# Altium project Arduino_DIY_V1.0.PrjPcb
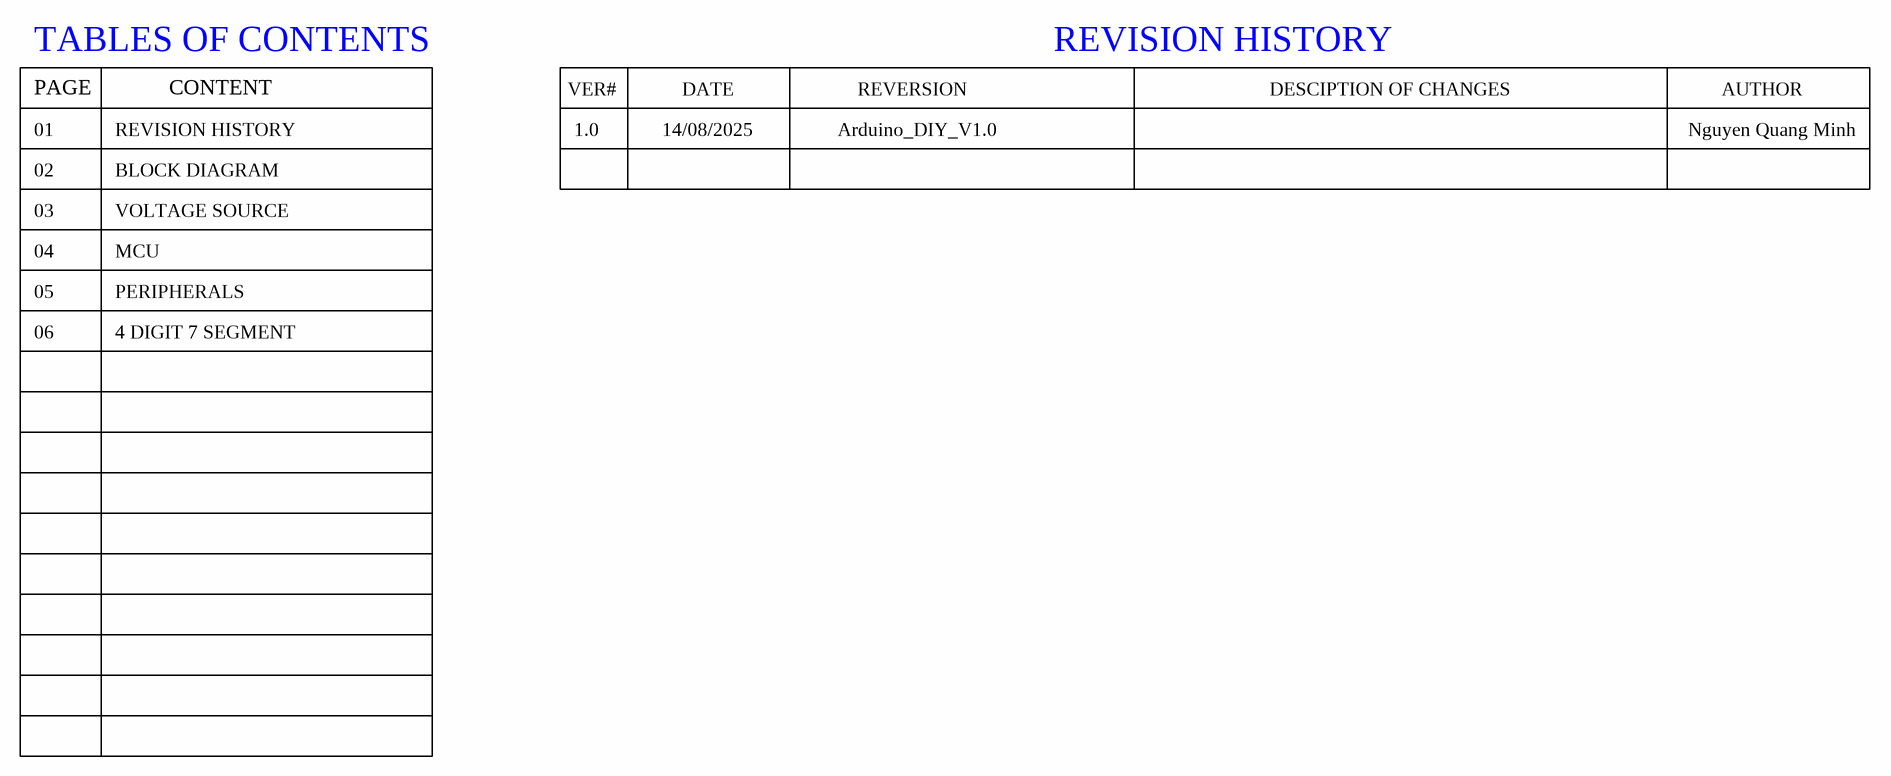
[diagram p0: REVISION HISTORY.SchDoc]
6 sheets, 122 parts. Net scope: flat (ports and power ports of the same name join across sheets).
Board files: Arduino_DIY_V1.0.PcbDoc, Multi_Board.PcbDoc
Sheets:
  REVISION HISTORY.SchDoc
  BLOCK DIAGRAM.SchDoc
  VOLTAGE SOURCE.SchDoc
  MCU.SchDoc
  PERIPHERALS.SchDoc
  4 DIGIT 7 SEGMENT.SchDoc

## Sheet REVISION HISTORY.SchDoc: REVISION HISTORY
size A3; Author: NGUYEN QUANG MINH; SheetNumber: 1; SheetTotal: 5; ProjectTitle: Arduino_DIY_V1.0

### Notes on the sheet
- TABLES OF CONTENTS
- PAGE
- CONTENT
- VER#
- DATE
- REVERSION
- REVISION HISTORY
- DESCIPTION OF CHANGES
- AUTHOR
- 01
- 1.0
- 14/08/2025
- Arduino_DIY_V1.0
- Nguyen Quang Minh
- 02
- 03
- BLOCK DIAGRAM
- VOLTAGE SOURCE
- 04
- MCU
- 05
- 06
- PERIPHERALS
- 4 DIGIT 7 SEGMENT
- Author:
- Title:
- Size:
- A3
- Project:
- Revision:
- Modified Date:
- CheckedBy:
- Date:
- SW Version:

## Sheet BLOCK DIAGRAM.SchDoc: BLOCK DIAGRAM
size A3; Author: NGUYEN QUANG MINH; SheetNumber: 2; SheetTotal: 5; ProjectTitle: Arduino_DIY_V1.0

### Notes on the sheet
- Author:
- Title:
- Size:
- A3
- Project:
- Revision:
- Modified Date:
- CheckedBy:
- Date:
- SW Version:
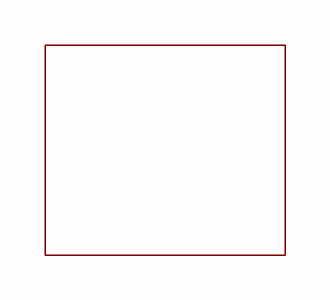
[diagram p1: BLOCK DIAGRAM.SchDoc]

## Sheet VOLTAGE SOURCE.SchDoc: VOLTAGE SOURCE
size A3; Author: NGUUYEN QUANG MINH; Organization: My Company; Address1: Address Line 1; Address2: Address Line 2; Address3: Address Line 3; Address4: Address Line 4; SheetNumber: 3; SheetTotal: 5; ProjectTitle: Arduino_DIY_V1.0
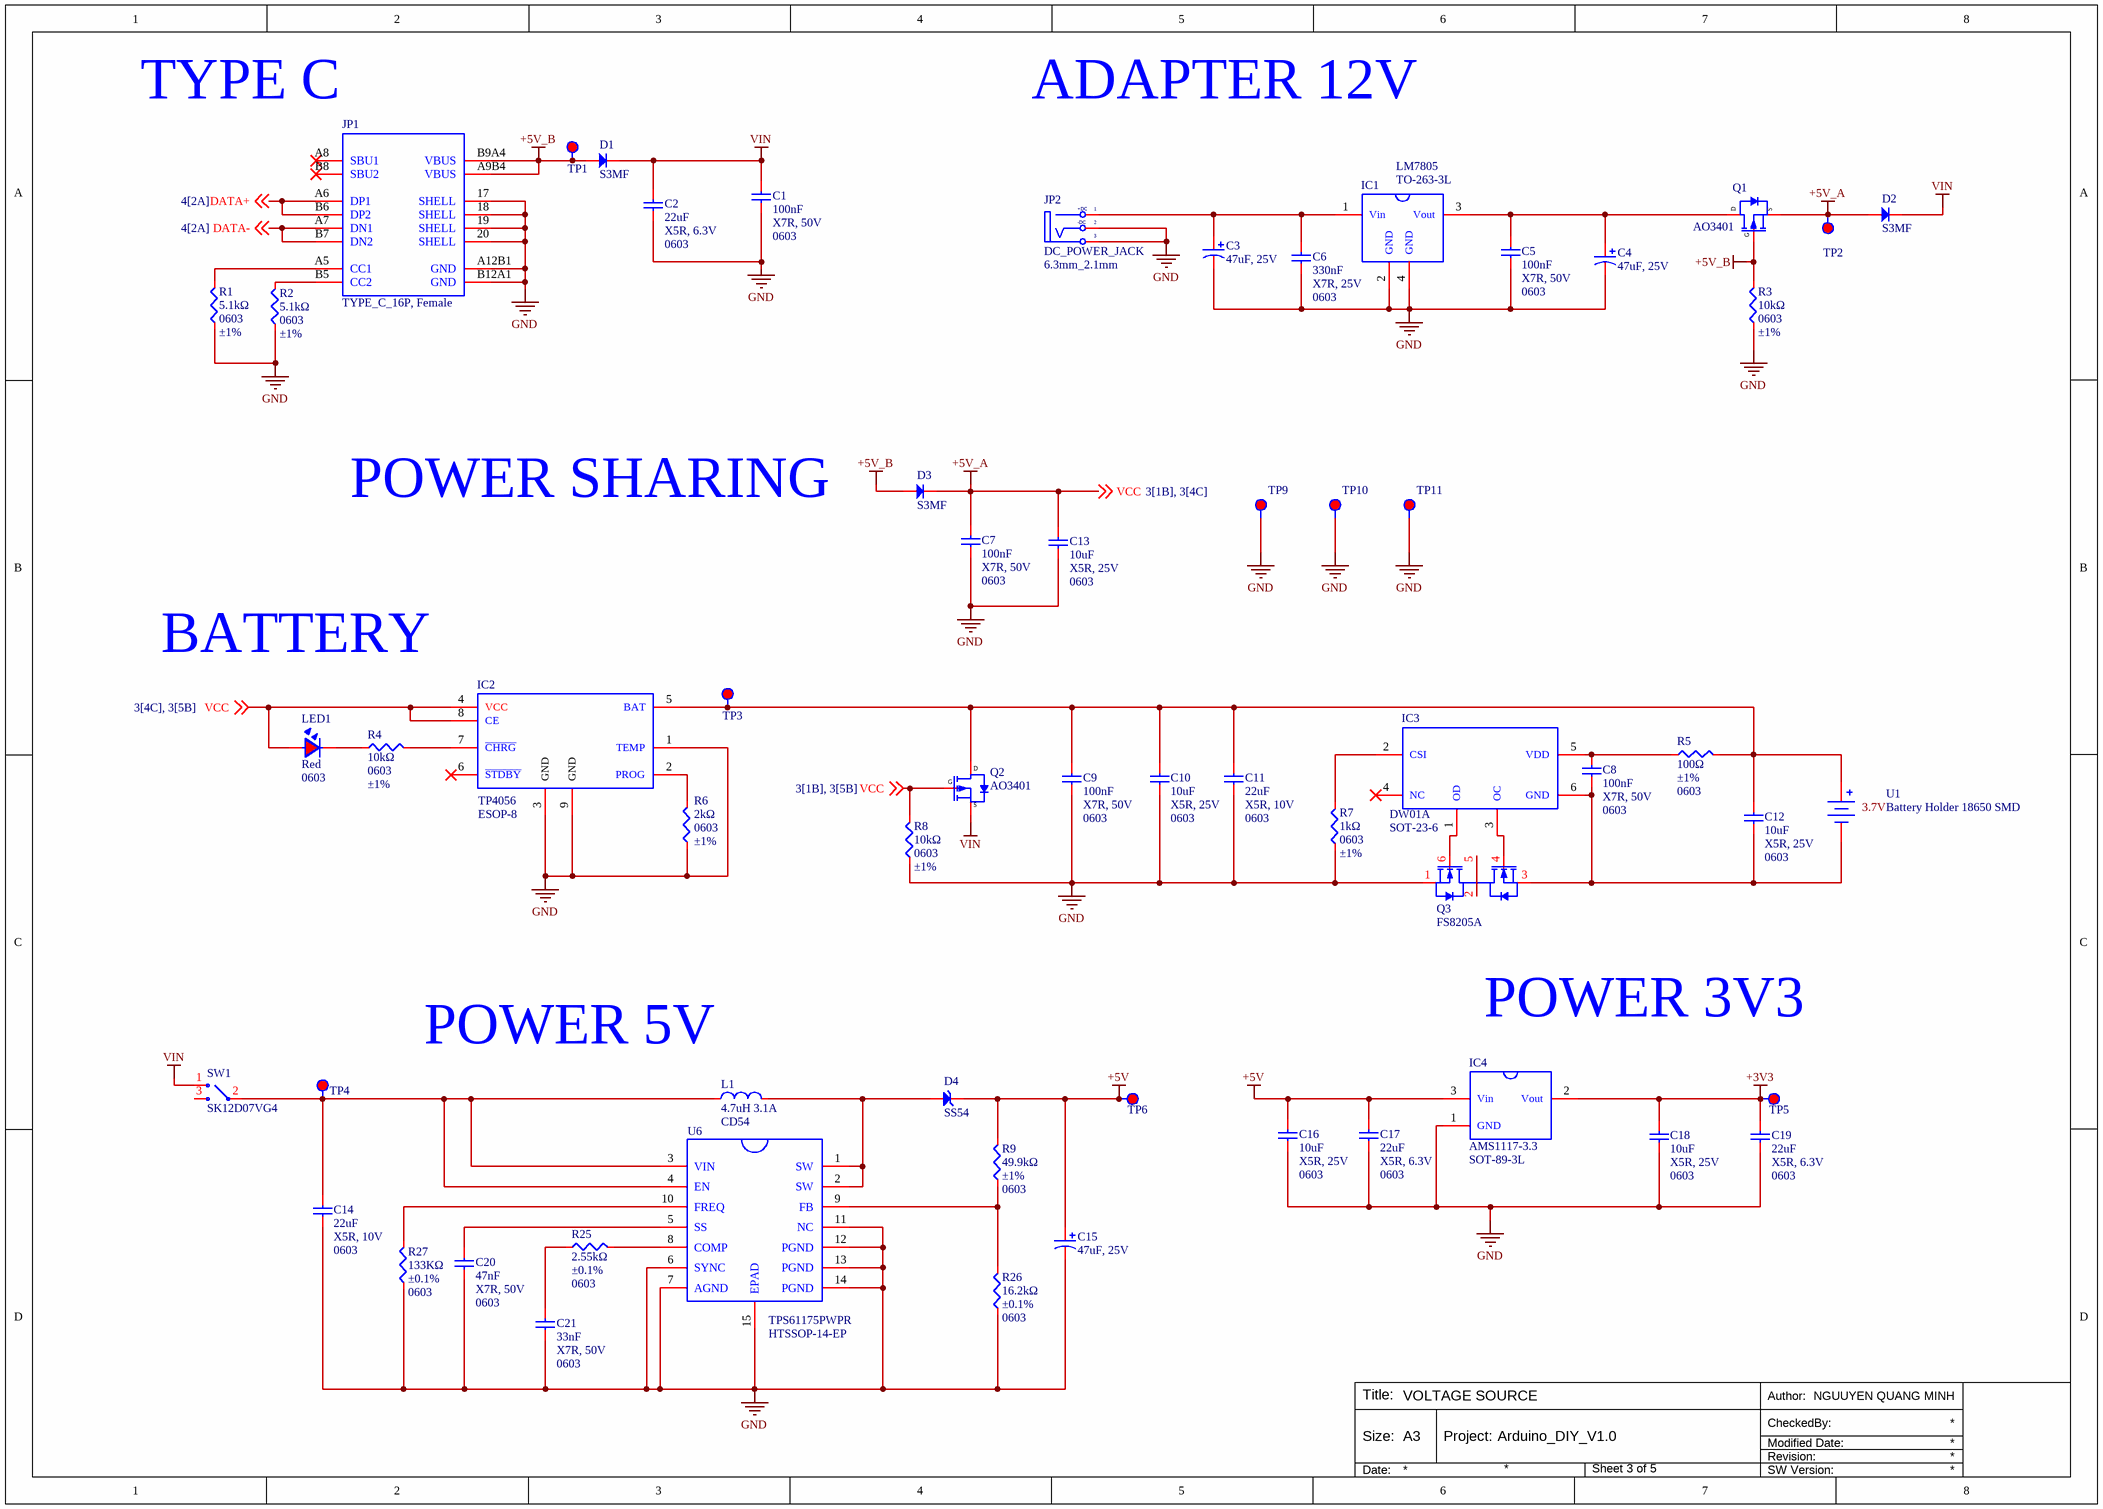
[diagram p2: VOLTAGE SOURCE.SchDoc]

### Parts
C1  100nF  Temperature Coefficient: X7R, 50V  Package: 0603  [C0603]
C2  22uF  Temperature Coefficient: X5R, 6.3V  Package: 0603  [C0603]
C3  47uF, 25V  [CAP_ALU_C]
C4  47uF, 25V  [CAP_ALU_C]
C5  100nF  Temperature Coefficient: X7R, 50V  Package: 0603  [C0603]
C6  330nF  Temperature Coefficient: X7R, 25V  Package: 0603  [C0603]
C7  100nF  Temperature Coefficient: X7R, 50V  Package: 0603  [C0603]
C8  100nF  Temperature Coefficient: X7R, 50V  Package: 0603  [C0603]
C9  100nF  Temperature Coefficient: X7R, 50V  Package: 0603  [C0603]
C10  10uF  Temperature Coefficient: X5R, 25V  Package: 0603  [C0603]
C11  22uF  Temperature Coefficient: X5R, 10V  Package: 0603  [C0603]
C12  10uF  Temperature Coefficient: X5R, 25V  Package: 0603  [C0603]
C13  10uF  Temperature Coefficient: X5R, 25V  Package: 0603  [C0603]
C14  22uF  Temperature Coefficient: X5R, 10V  Package: 0603  [C0603]
C15  47uF, 25V  [CAP_ALU_C]
C16  10uF  Temperature Coefficient: X5R, 25V  Package: 0603  [C0603]
C17  22uF  Temperature Coefficient: X5R, 6.3V  Package: 0603  [C0603]
C18  10uF  Temperature Coefficient: X5R, 25V  Package: 0603  [C0603]
C19  22uF  Temperature Coefficient: X5R, 6.3V  Package: 0603  [C0603]
C20  47nF  Temperature Coefficient: X7R, 50V  Package: 0603  [C0603]
C21  33nF  Temperature Coefficient: X7R, 50V  Package: 0603  [C0603]
D1  S3MF  [D_SMAF_L3.5-W2.6-LS4.7-RD]
D2  S3MF  [D_SMAF_L3.5-W2.6-LS4.7-RD]
D3  S3MF  [D_SMAF_L3.5-W2.6-LS4.7-RD]
D4  SS54  [SMC]
IC1  LM7805  [TO-263-3L]
IC2  TP4056  [ESOP-8]
IC3  DW01A  [SOT-23-6]
IC4  AMS1117-3.3  [SOT-89-3L]
JP1  TYPE_C_16P, Female  [TYPE_C_16P]
JP2  DC_POWER_JACK  Reference: 6.3mm_2.1mm  [DC_POWER_JACK_6.3mm_2.1mm]
L1  4.7uH 3.1A  [CD54]
LED1  Red  Package: 0603  [LED0603_RED]
Q1  AO3401  [TF_SOT_23_3]
Q2  AO3401  [TF_SOT_23_3]
Q3  FS8205A  [TF_SOT23-6]
R1  5.1kΩ  Package: 0603  Tolerance: ±1%  [R0603]
R2  5.1kΩ  Package: 0603  Tolerance: ±1%  [R0603]
R3  10kΩ  Package: 0603  Tolerance: ±1%  [R0603]
R4  10kΩ  Package: 0603  Tolerance: ±1%  [R0603]
R5  100Ω  Tolerance: ±1%  Package: 0603  [R0603]
R6  2kΩ  Package: 0603  Tolerance: ±1%  [R0603]
R7  1kΩ  Package: 0603  Tolerance: ±1%  [R0603]
R8  10kΩ  Package: 0603  Tolerance: ±1%  [R0603]
R9  49.9kΩ  Tolerance: ±1%  Package: 0603  [R0603]
R25  2.55kΩ  Tolerance: ±0.1%  Package: 0603  [R0603]
R26  16.2kΩ  Tolerance: ±0.1%  Package: 0603  [R0603]
R27  133KΩ  Tolerance: ±0.1%  Package: 0603  [R0603]
SW1  SK12D07VG4  [SK12D07VG4]
TP1  Test Point  [TEST_POINT]  (value not drawn)  (no BOM)
TP2  Test Point  [TEST_POINT]  (value not drawn)  (no BOM)
TP3  Test Point  [TEST_POINT]  (value not drawn)  (no BOM)
TP4  Test Point  [TEST_POINT]  (value not drawn)  (no BOM)
TP5  Test Point  [TEST_POINT]  (value not drawn)  (no BOM)
TP6  Test Point  [TEST_POINT]  (value not drawn)  (no BOM)
TP9  Test Point  [TEST_POINT]  (value not drawn)  (no BOM)
TP10  Test Point  [TEST_POINT]  (value not drawn)  (no BOM)
TP11  Test Point  [TEST_POINT]  (value not drawn)  (no BOM)
U1  Battery Holder 18650 SMD  [PIN_18650_1S_HOLDER_SMD]
U6  TPS61175PWPR  [HTSSOP-14-EP]

### Nets
+3V3: C18.2 C19.2 IC4.2(Vout) TP5.1
+5V: C15.1 C16.2 C17.2 D4.1 IC4.3(Vin) R9.2 TP6.1
+5V_A: C7.2 C13.2 D2.2 D3.1 IC2.4(VCC) IC2.8(CE) LED1.1 Q1.2(S) Q2.1(G) R8.2 TP2.1 ; off-sheet VCC  [also labelled VCC]
+5V_B: D1.2 D3.2 JP1.A9B4(VBUS) JP1.B9A4(VBUS) Q1.1(G) R3.2 TP1.1
GND: C1.1 C2.1 C3.2 C4.2 C5.1 C6.1 C7.1 C9.1 C10.1 C11.1 C13.1 C14.1 C15.2 C16.1 C17.1 C18.1 C19.1 C20.1 C21.1 IC1.2(GND) IC1.4(GND) IC2.1(TEMP) IC2.3(GND) IC2.9(GND) IC4.1(GND) JP1.17(SHELL) JP1.18(SHELL) JP1.19(SHELL) JP1.20(SHELL) JP1.A12B1(GND) JP1.B12A1(GND) JP2.2(TN) JP2.3(S) Q3.1(S1) R1.1 R2.1 R3.1 R6.1 R7.1 R8.1 R26.1 R27.1 TP9.1 TP10.1 TP11.1 U6.6(SYNC) U6.7(AGND) U6.11(NC) U6.12(PGND) U6.13(PGND) U6.14(PGND) U6.15(EPAD)
VIN: C1.2 C2.2 D1.1 D2.1 Q2.2(S) SW1.1
DATA+: JP1.A6(DP1) JP1.B6(DP2) ; off-sheet DATA+
DATA-: JP1.A7(DN1) JP1.B7(DN2) ; off-sheet DATA-
NetC3_1: C3.1 C6.2 IC1.1(Vin) JP2.1(T)
NetC4_1: C4.1 C5.2 IC1.3(Vout) Q1.3(D)
NetC8_1: C8.1 C12.1 IC3.6(GND) Q3.3(S2) U1.2
NetC8_2: C8.2 IC3.5(VDD) R5.1
NetC9_2: C9.2 C10.2 C11.2 C12.2 IC2.5(BAT) Q2.3(D) R5.2 TP3.1 U1.1
NetC14_2: C14.2 L1.1 SW1.2 TP4.1 U6.3(VIN) U6.4(EN)
NetC20_2: C20.2 U6.5(SS)
NetC21_2: C21.2 R25.1
NetD4_2: D4.2 L1.2 U6.1(SW) U6.2(SW)
NetIC2_2: IC2.2(PROG) R6.2
NetIC2_7: IC2.7(~{CHRG}) R4.2
NetIC3_1: IC3.1(OD) Q3.6(G1)
NetIC3_2: IC3.2(CSI) R7.2
NetIC3_3: IC3.3(OC) Q3.4(G2)
NetJP1_A5: JP1.A5(CC1) R1.2
NetJP1_B5: JP1.B5(CC2) R2.2
NetLED1_2: LED1.2 R4.1
NetQ3_2: Q3.2(D1/D2) Q3.5(D1/D2)
NetR9_1: R9.1 R26.2 U6.9(FB)
NetR25_2: R25.2 U6.8(COMP)
NetR27_2: R27.2 U6.10(FREQ)

Not connected (* = marked no-connect by the designer): IC2 6(~{STDBY})*; IC3 4(NC)*; JP1 A8(SBU1)* B8(SBU2)*; SW1 3

### Notes on the sheet
- TYPE C
- ADAPTER 12V
- POWER SHARING
- BATTERY
- POWER 5V
- POWER 3V3
- Author:
- Title:
- Size:
- A3
- Project:
- Revision:
- Modified Date:
- CheckedBy:
- Date:
- SW Version:
- (in symbol DC_POWER_JACK_6.3mm_2.1mm) +DC; -DC
- (in symbol PIN_18650_1S_HOLDER_SMD) 3.7V

### Library data of the parts
C1 C5 C7-C9 = C0603_MLCC_100nF_X7R_50V: 50V 100nF X7R ±10% 0603 Multilayer Ceramic Capacitors MLCC - SMD/SMT ROHS; Manufacturer: YAGEO; Mfr. Part: CC0603KRX7R9BB104; LCSC Part: C14663; Capacitance: 100nF; Link: https://www.lcsc.com/product-detail/C14663.html; Tolerance: ±10%; Voltage Rating: 50V
C2 C17 C19 = C0603_MLCC_22uF_X5R_6.3V: 6.3V 22uF X5R ±20% 0603 Multilayer Ceramic Capacitors MLCC - SMD/SMT ROHS; Manufacturer: YAGEO; Mfr. Part: CC0603MRX5R5BB226; LCSC Part: C109448; Capacitance: 22uF; Link: https://www.lcsc.com/product-detail/C109448.html; Voltage Rating: 6.3V; Tolerance: ±20%
C3 C4 C15 = C_ALU_47uF_25V_C: 25V ±20% 47uF SMD,D5xL6.1mm Hybrid Aluminum Electrolytic Capacitors ROHS; Manufacturer: PANASONIC; Mfr. Part: EEHZK1E470R; LCSC Part: C542300; Capacitance: 47uF; Link: https://www.lcsc.com/product-detail/C542300.html; Voltage Rating: 25V; Tolerance: ±20%; Package: C
C6 = C0603_MLCC_330nF_X7R_25V: 25V 330nF X7R ±10% 0603 Multilayer Ceramic Capacitors MLCC - SMD/SMT ROHS; Manufacturer: YAGEO; Mfr. Part: CC0603KRX7R8BB334; LCSC Part: C107070; Capacitance: 330nF; Link: https://www.lcsc.com/product-detail/C107070.html; Voltage Rating: 25V; Tolerance: ±10%
C10 C12 C13 C16 C18 = C0603_MLCC_10uF_X5R_25V: 25V 10uF X5R ±20% 0603 Multilayer Ceramic Capacitors MLCC - SMD/SMT ROHS; Manufacturer: YAGEO; Mfr. Part: CC0603MRX5R8BB106; LCSC Part: C596327; Capacitance: 10uF; Link: https://www.lcsc.com/product-detail/C596327.html; Tolerance: ±20%; Voltage Rating: 25V
C11 C14 = C0603_MLCC_22uF_X5R_10V: 10V 22uF X5R ±20% 0603 Multilayer Ceramic Capacitors MLCC - SMD/SMT ROHS; Manufacturer: Samsung Electro-Mechanics; Mfr. Part: CL10A226MP8NUNE; LCSC Part: C86295; Capacitance: 22uF; Link: https://www.lcsc.com/product-detail/C86295.html; Voltage Rating: 10V; Tolerance: ±20%
C20 = C0603_MLCC_47nF_X7R_50V: 50V 47nF X7R ±10% 0603 Multilayer Ceramic Capacitors MLCC - SMD/SMT ROHS; Manufacturer: YAGEO; Mfr. Part: CC0603KRX7R9BB473; LCSC Part: C107093; Capacitance: 47nF; Link: https://www.lcsc.com/product-detail/C107093.html; Voltage Rating: 50V; Tolerance: ±10%
C21 = C0603_MLCC_33nF_X7R_50V: 50V 33nF X7R ±10% 0603 Multilayer Ceramic Capacitors MLCC - SMD/SMT ROHS; Manufacturer: YAGEO; Mfr. Part: CC0603KRX7R9BB333; LCSC Part: C106856; Capacitance: 33nF; Link: https://www.lcsc.com/product-detail/C106856.html; Tolerance: ±10%; Voltage Rating: 50V
D1-D3 = S3MF: 3A Independent Type 1.1V@3A 1kV SMAF Diodes - General Purpose ROHS; Manufacturer: Shandong Jingdao Microelectronics; Manufacture Part Number: S3MF; Packaging: Cut Tape; Link: https://www.lcsc.com/product-detail/Diodes-General-Purpose_Shandong-Jingdao-Microelectronics-S3MF_C123928.html?s_z=n_s3m; Package: SMAF
D4 = SS54: 40V Independent 550mV@5A 5A SMC Schottky Diodes ROHS; Manufacturer: TWGMC; Manufacture Part Number: SS54; Link: https://www.lcsc.com/product-detail/C5204950.html?s_z=n_B540C-13-F; Package: SMC; Voltage - Forward(Vf@If): 550mV@5A; Category: Schottky Diodes
IC1 = LM7805_TO-263-3L: 62dB@(120Hz) 1A Fixed 4.8V~5.2V Positive 35V TO-263-3L Voltage Regulators - Linear, Low Drop Out (LDO) Regulators ROHS; Manufacturer: HANSCHIP semiconductor; Mfr. Part: LM7805SRG; Number of Outputs: 1; LCSC Part: C5145372; Link: https://www.lcsc.com/product-detail/C5145372.html?s_z=n_lm7805; Category: Power Management (PMIC)/Voltage Regulators - Linear, Low Drop Out (LDO) Regulators; Output Current: 1A; Output Voltage: 4.8V~5.2V; Output Configuration: Positive; Operating Temperature: -40℃~+85℃@(Ta); Voltage - Supply: 35V; Package: TO-263-3L
IC2 = TP4056_ESOP-8: 4V~6V Lithium-ion/Polymer 1 ESOP-8 Battery Management ROHS; Manufacturer: TPOWER; Key Attributes: 1A Lithium Battery Charger; Number of Cells: 1; Charging Saturation Voltage: 4.2V; Mfr. Part: TP4056; LCSC Part: C382139; Voltage - Supply: 4V~6V; Operating Temperature: -40℃~+85℃; Type of Battery: Lithium-ion/Polymer; Link: https://www.lcsc.com/product-detail/C382139.html?s_z=n_tp4056; Package: ESOP-8
IC3 = DW01A: 1.5V~8V Lithium-ion/Polymer 1 SOT-23-6 Battery Management ROHS; Manufacturer: YONGYUTAI; Key Attributes: Lithium battery protection circuit; Number of Cells: 1; Charging Saturation Voltage: 4.3V; Mfr. Part: DW01A; LCSC Part: C2927799; Voltage - Supply: 1.5V~8V; Operating Temperature: -40℃~+85℃; Type of Battery: Lithium-ion/Polymer; Link: https://www.lcsc.com/product-detail/C2927799.html?s_z=n_dw01a; Package: SOT-23-6
IC4 = AMS1117-3.3_SOT-89-3L: 1A Fixed 3.3V Positive 15V SOT-89-3L Voltage Regulators - Linear, Low Drop Out (LDO) Regulators ROHS; Manufacturer: HXY MOSFET; Voltage Dropout: 12mV@(1A); Number of Outputs: 1; Voltage - Supply: 16V; Mfr. Part: AMS1117-3.3; LCSC Part: C5345982; Link: https://www.lcsc.com/product-detail/C5345982.html?s_z=n_ams1117; Category: Power Management (PMIC)/Voltage Regulators - Linear, Low Drop Out (LDO) Regulators; Output Current: 1A; Output Voltage: 3.3V; Output Configuration: Positive; Operating Temperature: 0℃~+125℃@(Ta); Package: SOT-89-3L
JP1 = TYPE_C_16P: 3A USB 3.1 1 Surface Mount, Right Angle 16P Female -40℃~+85℃ Type-C SMD USB Connectors ROHS; Manufacturer: SHOU HAN; Mfr. Part: TYPE-C-3.1-16PIN; Protocol Standard: USB 3.1; LCSC Part: C7507405; Package: SMD; Current Rating-Power: 3A; Mounting Type: Surface Mount, Right Angle; Number of Contacts: 16P; Gender: Female; Operating Temperature: -40℃~+85℃; Link: https://www.lcsc.com/product-detail/C7507405.html?s_z=n_SHOU%2520HAN%2520TYPE-C-3.1-16PIN
JP2 = DC_POWER_JACK_6.3mm_2.1mm: Right Angle DC Power Jack -40℃~+85℃ 2.1mm 6.3mm 3A 500V Through Hole DC Power Connectors ROHS; Manufacturer: Lian Xin Technology; Mfr. Part: XDJK-0051-025; LCSC Part: C7498153; Package: Through Hole; Current Rating-Power: 3A; Link: https://www.lcsc.com/product-detail/C7498153.html?s_z=n_XDJK-0051-025; Connector Type: DC Power Jack; Operating Temperature: -40℃~+85℃; Inside Contact Diameter: 2.1mm; Outside Contact Diameter: 6.3mm; Current Rating: 3A; Voltage Rating (Max): 500V
L1 = CD54_4.7uH_3.1A: 3.1A 4.7uH ±20% SMD,5.8x5.2mm Power Inductors ROHS; Manufacturer: Ceaiya; Manufacture Part Number: CD54-4R7M; Packaging: Cut Tape; Link: https://www.lcsc.com/product-detail/Power-Inductors_Ceaiya-CD54-4R7M_C7588991.html?s_z=n_cd54%204.7uH; Inductor: 4.7uH; Current: 3.1A; Package: CD54
LED1 = LED0603_Red: 20mA 230mcd Water Clear -40℃~+85℃ 630nm Red 120° 75mW 1.95V 0603 LED Indication - Discrete ROHS; Manufacturer: Kingbright; Mfr. Part: APT1608SURCK; Key Attributes: 1.6 x 0.8 mm SMD Chip LED Lamp; LCSC Part: C5875723; Illumination Color: Red; Power(Watts): 75mW; Voltage - Forward(Vf): 1.95V; Forward Current: 20mA; Operating Temperature: -40℃~+85℃; Link: https://www.lcsc.com/product-detail/C5875723.html
Q1 Q2 = AO3401: 30V 4.2A 42mΩ@10V,4A 1.4W 800mV@250uA 1 Piece P-Channel SOT-23 MOSFETs ROHS; Manufacturer: ElecSuper; Manufacture Part Number: AO3401; Packaging: Cut Tape (CT); Link: https://www.lcsc.com/product-detail/MOSFETs_ElecSuper-AO3401_C5224195.html; Drain Source Voltage (Vdss): 30V; Continuous Drain Current (Id): 4.2A; Power Dissipation (Pd): 1.4W; Package: SOT-23-3
Q3 = FS8205A: 20V 25mΩ@2.5V,3A 1.5W 500mV SOT-23-6 MOSFETs ROHS; Manufacturer: TECH PUBLIC; Manufacture Part Number: FS8205A; Packaging: Cut Tape (CT); Link: https://www.lcsc.com/product-detail/MOSFETs_TECH-PUBLIC-FS8205A_C2830320.html?s_z=n_fs8205; Drain to Source Voltage: 20V; RDS(on): 25mΩ@2.5V,3A; Gate Threshold Voltage (Vgs(th)@Id): 500mV; Package: SOT-23-6
R1 R2 = R0603_5.1kΩ_±1%: 100mW Thick Film Resistor 75V ±100ppm/℃ ±1% 5.1kΩ 0603 Chip Resistor - Surface Mount ROHS; Manufacturer: YAGEO; Mfr. Part: RC0603FR-075K1L; LCSC Part: C105580; Resistance: 5.1kΩ; Operating Temperature: -55℃~+155℃; Link: https://www.lcsc.com/product-detail/C105580.html; Power(Watts): 100mW
R3 R4 R8 = R0603_10kΩ_±1%: 100mW Thick Film Resistor 75V ±100ppm/℃ ±1% 10kΩ 0603 Chip Resistor - Surface Mount ROHS; Manufacturer: YAGEO; Mfr. Part: RC0603FR-0710KL; LCSC Part: C98220; Resistance: 10kΩ; Operating Temperature: -55℃~+155℃; Link: https://www.lcsc.com/product-detail/C98220.html
R5 = R0603_100Ω_±1%: 100mW Thick Film Resistor 75V ±100ppm/℃ ±1% 100Ω 0603 Chip Resistor - Surface Mount ROHS; Manufacturer: YAGEO; Mfr. Part: RC0603FR-13100RL; LCSC Part: C845629; Resistance: 100Ω; Operating Temperature: -55℃~+155℃; Link: https://www.lcsc.com/product-detail/C845629.html
R6 = R0603_2kΩ_±1%: 100mW Thick Film Resistor 75V ±100ppm/℃ ±1% 2kΩ 0603 Chip Resistor - Surface Mount ROHS; Manufacturer: YAGEO; Mfr. Part: RC0603FR-072KL; LCSC Part: C105576; Resistance: 2kΩ; Operating Temperature: -55℃~+155℃; Link: https://www.lcsc.com/product-detail/C105576.html
R7 = R0603_1kΩ_±1%: 100mW Thick Film Resistor 75V ±100ppm/℃ ±1% 1kΩ 0603 Chip Resistor - Surface Mount ROHS; Manufacturer: YAGEO; Mfr. Part: RC0603FR-071KL; LCSC Part: C22548; Resistance: 1kΩ; Operating Temperature: -55℃~+155℃; Link: https://www.lcsc.com/product-detail/C22548.html
R9 = R0603_49.9KΩ_±1%: 100mW Thick Film Resistor 75V ±100ppm/℃ ±1% 49.9kΩ 0603 Chip Resistor - Surface Mount ROHS; Manufacturer: YAGEO; Mfr. Part: RC0603FR-0749K9L; LCSC Part: C114624; Resistance: 49.9kΩ; Operating Temperature: -55℃~+155℃; Link: https://www.lcsc.com/product-detail/C114624.html?s_z=n_C114624
R25 = R0603_2.55KΩ_±0.1%: 100mW Thin Film Resistor 75V ±25ppm/℃ ±0.1% 2.55kΩ 0603 Chip Resistor - Surface Mount ROHS; Manufacturer: YAGEO; Mfr. Part: RT0603BRD072K55L; LCSC Part: C326728; Resistance: 2.55kΩ; Operating Temperature: -55℃~+155℃; Link: https://www.lcsc.com/product-detail/C326728.html
R26 = R0603_16.2KΩ_±0.1%: 100mW Thin Film Resistor 75V ±50ppm/℃ ±0.1% 16.2kΩ 0603 Chip Resistor - Surface Mount ROHS; Manufacturer: YAGEO; Mfr. Part: RT0603BRE0716K2L; LCSC Part: C728602; Resistance: 16.2kΩ; Operating Temperature: -55℃~+155℃; Link: https://www.lcsc.com/product-detail/C728602.html
R27 = R0603_133KΩ_±0.1%: 100mW Thin Film Resistor 75V ±50ppm/℃ ±0.1% 133kΩ 0603 Chip Resistor - Surface Mount ROHS; Manufacturer: YAGEO; Mfr. Part: RT0603BRE07133KL; LCSC Part: C861659; Resistance: 133KΩ; Operating Temperature: -55℃~+155℃; Link: https://www.lcsc.com/product-detail/C861659.html
SW1 = SK12D07VG4: 500mA SPDT 50V 5千次 Plugin Slide Switches ROHS; Manufacturer: SHOU HAN; Manufacture Part Number: SK12D07VG4; Link: https://www.lcsc.com/product-detail/Slide-Switches_SHOU-HAN-SK12D07VG4_C393937.html; Package: Plugin
TP1-TP6 TP9-TP11 = TEST_POINT
U1 = PIN_18650_1S_HOLDER_SMD: Battery Holder -10℃~+100℃ Gold Phosphor Bronze Button And Strip Battery Connector ROHS; Manufacturer: MYOUNG; Mfr. Part: BH-18650-B5BA008; Battery Type: 18650; LCSC Part: C5371777; Package: ---; Connector Type: Battery Holder; Link: https://www.lcsc.com/product-detail/C5371777.html?s_z=h_BATTERRY%252018650%2520HOLER
U6 = TPS61175PWPR: Boost Adjustable 2.9V~38V 2.9V~18V 3A HTSSOP-14-EP DC-DC Converters ROHS; Manufacturer: TI; Frequency - Switching: 2.2MHz; Number of Outputs: 1; Package: HTSSOP-14-EP; Mfr. Part: TPS61175PWPR; LCSC Part: C43276; Voltage - Supply: 2.9V~18V; Link: https://www.lcsc.com/product-detail/C43276.html?s_z=n_TPS61175; Function: Boost; Output Current: 3A

## Sheet MCU.SchDoc: MCU
size A3; Author: NGUYEN QUANG MINH; SheetNumber: 4; SheetTotal: 5; ProjectTitle: Arduino_DIY_V1.0
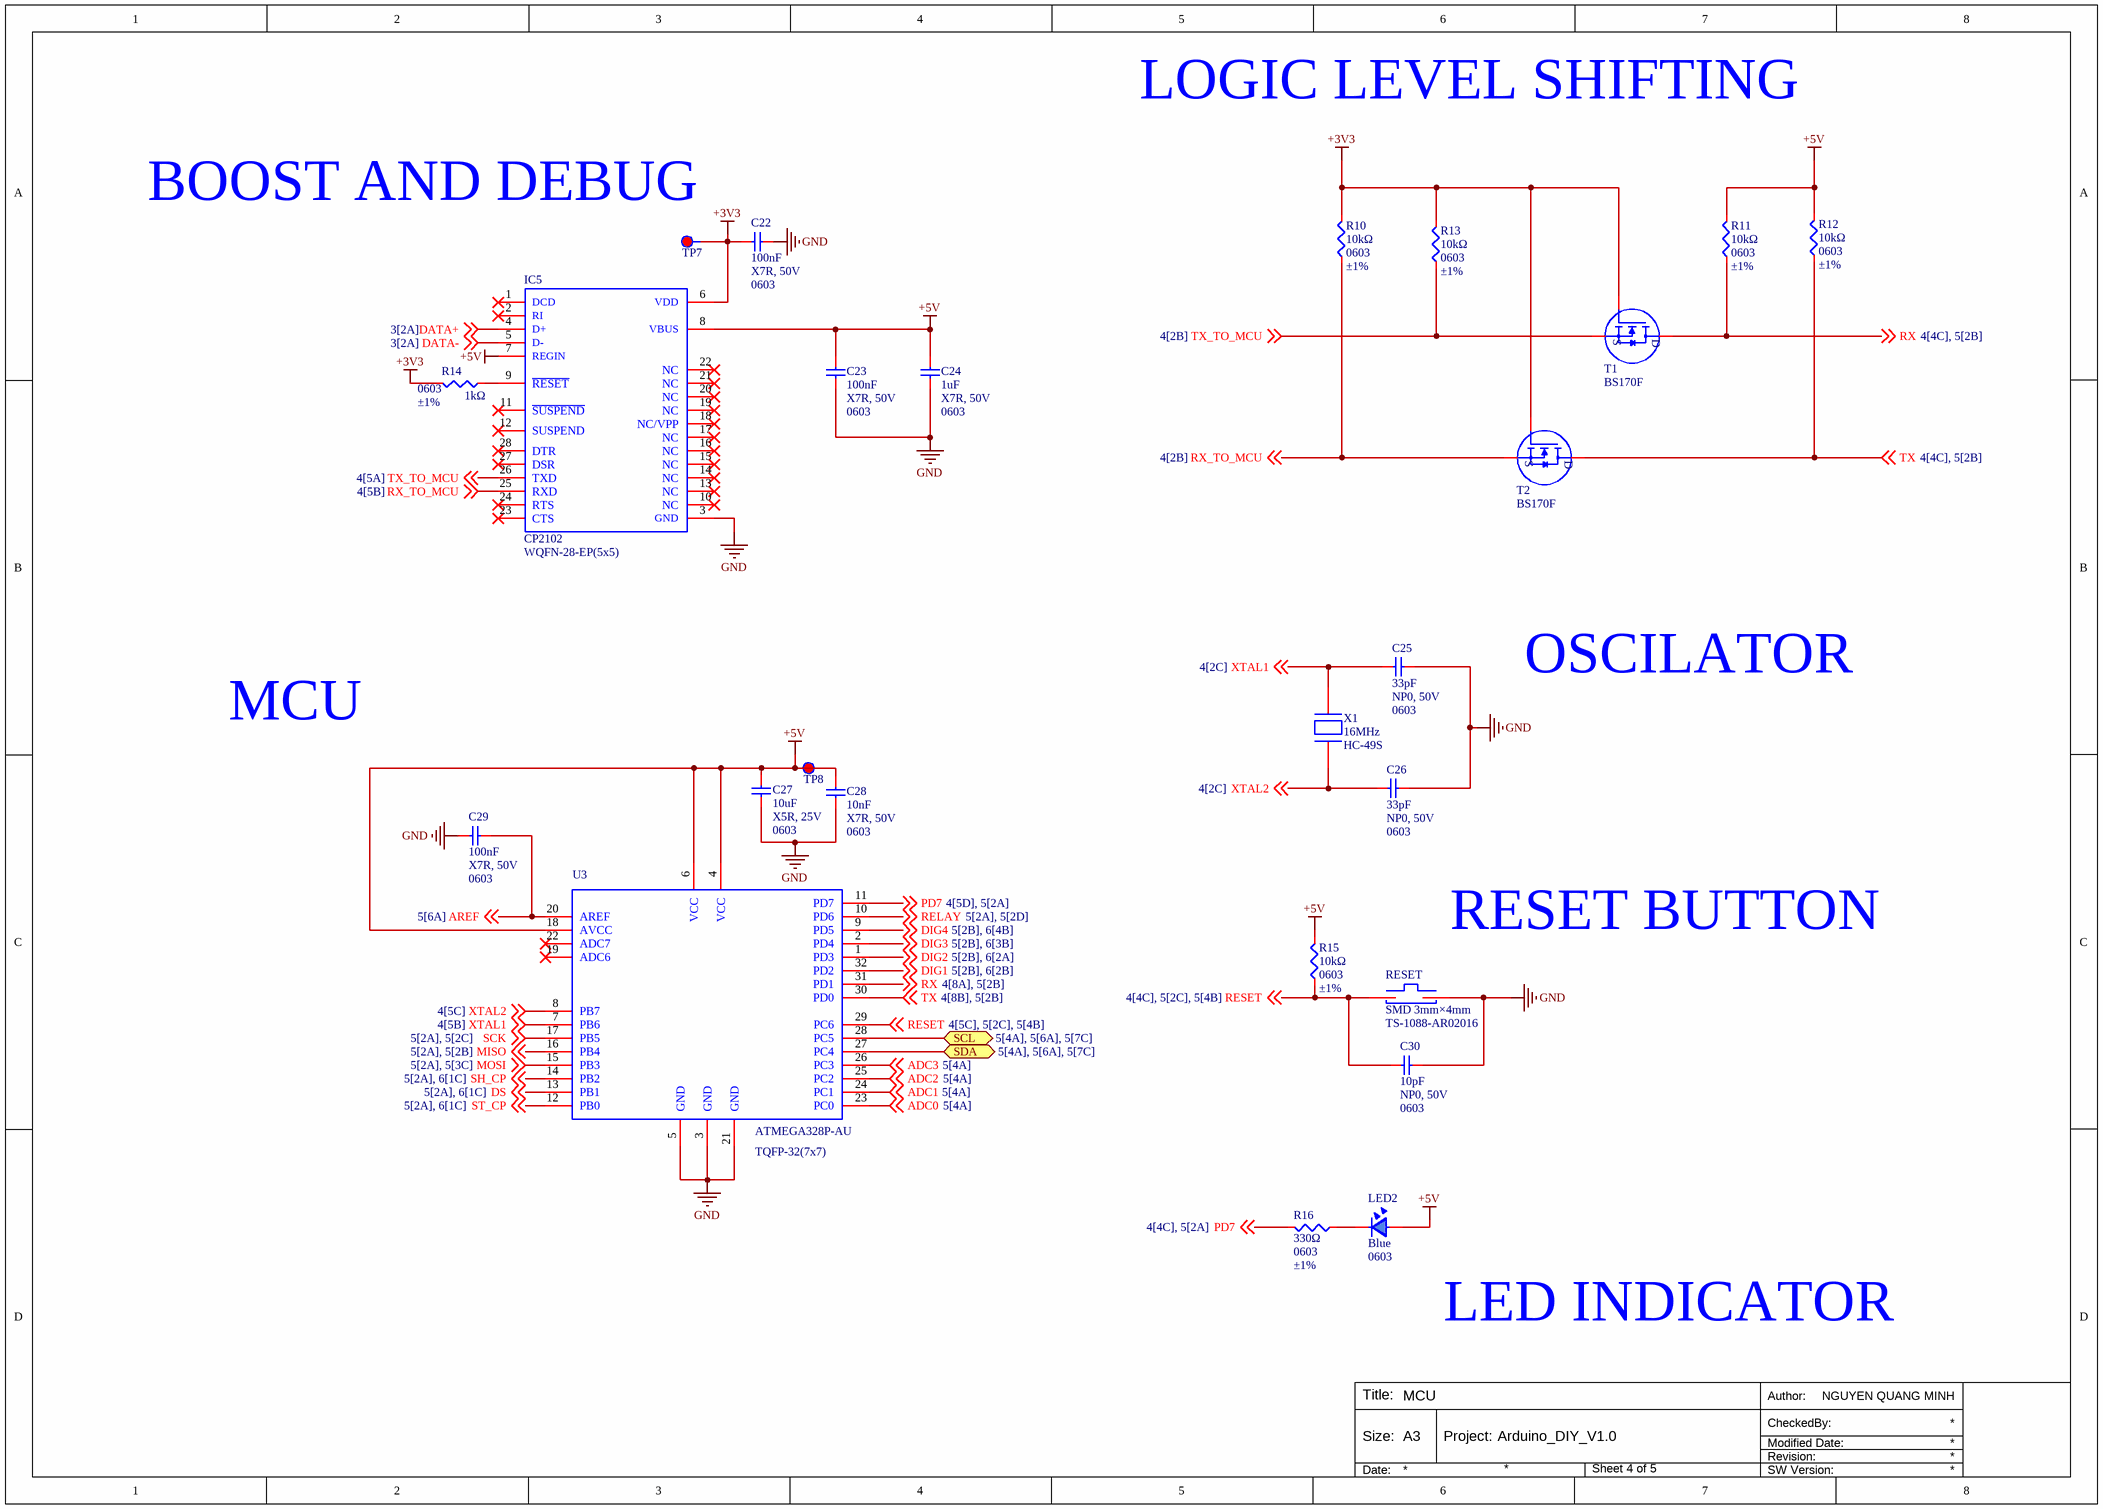
[diagram p3: MCU.SchDoc]

### Parts
C22  100nF  Temperature Coefficient: X7R, 50V  Package: 0603  [C0603]
C23  100nF  Temperature Coefficient: X7R, 50V  Package: 0603  [C0603]
C24  1uF  Temperature Coefficient: X7R, 50V  Package: 0603  [C0603]
C25  33pF  Temperature Coefficient: NP0, 50V  Package: 0603  [C0603]
C26  33pF  Temperature Coefficient: NP0, 50V  Package: 0603  [C0603]
C27  10uF  Temperature Coefficient: X5R, 25V  Package: 0603  [C0603]
C28  10nF  Temperature Coefficient: X7R, 50V  Package: 0603  [C0603]
C29  100nF  Temperature Coefficient: X7R, 50V  Package: 0603  [C0603]
C30  10pF  Temperature Coefficient: NP0, 50V  Package: 0603  [C0603]
IC5  CP2102  [WQFN-28-EP(5x5)]
LED2  Blue  Package: 0603  [LED0603_BLUE]
R10  10kΩ  Package: 0603  Tolerance: ±1%  [R0603]
R11  10kΩ  Package: 0603  Tolerance: ±1%  [R0603]
R12  10kΩ  Package: 0603  Tolerance: ±1%  [R0603]
R13  10kΩ  Package: 0603  Tolerance: ±1%  [R0603]
R14  1kΩ  Package: 0603  Tolerance: ±1%  [R0603]
R15  10kΩ  Package: 0603  Tolerance: ±1%  [R0603]
R16  330Ω  Package: 0603  Tolerance: ±1%  [R0603]
RESET  SMD 3mm×4mm  Mfr. Part: TS-1088-AR02016  [ROUND_BUTTON_SMD 3*4mm]
T1  BS170F  [SOT-23]
T2  BS170F  [SOT-23]
TP7  Test Point  [TEST_POINT]  (value not drawn)  (no BOM)
TP8  Test Point  [TEST_POINT]  (value not drawn)  (no BOM)
U3  ATMEGA328P-AU  Package: TQFP-32(7x7)  [TQFP-32 (7x7)]
X1  16MHz  [HC-49S]

### Ports
SCL (bidir, see 5[4A], 5[6A], 5[7C]), SDA (bidir, see 5[4A], 5[6A], 5[7C])

### Nets
+3V3: C22.2 IC5.6(VDD) R10.2 R13.2 R14.2 T1.1(G) T2.1(G) TP7.1
+5V: C23.2 C24.2 C27.2 C28.2 IC5.7(REGIN) IC5.8(VBUS) LED2.1 R11.2 R12.2 R15.2 TP8.1 U3.4(VCC) U3.6(VCC) U3.18(AVCC)
GND: C22.1 C23.1 C24.1 C25.2 C26.2 C27.1 C28.1 C29.1 C30.2 IC5.3(GND) RESET.2 U3.3(GND) U3.5(GND) U3.21(GND)
ADC0: U3.23(PC0) ; off-sheet ADC0
ADC1: U3.24(PC1) ; off-sheet ADC1
ADC2: U3.25(PC2) ; off-sheet ADC2
ADC3: U3.26(PC3) ; off-sheet ADC3
AREF: C29.2 U3.20(AREF) ; off-sheet AREF
DATA+: IC5.4(D+) ; off-sheet DATA+
DATA-: IC5.5(D-) ; off-sheet DATA-
DIG1: U3.32(PD2) ; off-sheet DIG1
DIG2: U3.1(PD3) ; off-sheet DIG2
DIG3: U3.2(PD4) ; off-sheet DIG3
DIG4: U3.9(PD5) ; off-sheet DIG4
DS: U3.13(PB1) ; off-sheet DS
MISO: U3.16(PB4) ; off-sheet MISO
MOSI: U3.15(PB3) ; off-sheet MOSI
PD7: R16.1 U3.11(PD7) ; off-sheet PD7
RELAY: U3.10(PD6) ; off-sheet RELAY
RESET: C30.1 R15.1 RESET.1 U3.29(PC6) ; off-sheet RESET
RX: R11.1 T1.3(D) U3.31(PD1) ; off-sheet RX
RX_TO_MCU: IC5.25(RXD) R10.1 T2.2(S) ; off-sheet RX_TO_MCU
SCK: U3.17(PB5) ; off-sheet SCK
SH_CP: U3.14(PB2) ; off-sheet SH_CP
ST_CP: U3.12(PB0) ; off-sheet ST_CP
TX: R12.1 T2.3(D) U3.30(PD0) ; off-sheet TX
TX_TO_MCU: IC5.26(TXD) R13.1 T1.2(S) ; off-sheet TX_TO_MCU
XTAL1: C25.1 U3.7(PB6) X1.2 ; off-sheet XTAL1
XTAL2: C26.1 U3.8(PB7) X1.1 ; off-sheet XTAL2
NetH2_1: U3.28(PC5) ; port SCL
NetH2_2: U3.27(PC4) ; port SDA
NetIC5_9: IC5.9(~{RESET}) R14.1
NetLED2_2: LED2.2 R16.2

Not connected (* = marked no-connect by the designer): IC5 1(DCD)* 2(RI)* 10(NC)* 11(~{SUSPEND})* 12(SUSPEND)* 13(NC)* 14(NC)* 15(NC)* 16(NC)* 17(NC)* 18(NC/VPP)* 19(NC)* 20(NC)* 21(NC)* 22(NC)* 23(CTS)* 24(RTS)* 27(DSR)* 28(DTR)*; U3 19(ADC6)* 22(ADC7)*

### Notes on the sheet
- LOGIC LEVEL SHIFTING
- BOOST AND DEBUG
- OSCILATOR
- MCU
- RESET BUTTON
- LED INDICATOR
- Author:
- Title:
- Size:
- A3
- Project:
- Revision:
- Modified Date:
- CheckedBy:
- Date:
- SW Version:

### Library data of the parts
C22 C23 C29 = C0603_MLCC_100nF_X7R_50V: as C1 on sheet VOLTAGE SOURCE; LCSC Part: C14663; Capacitance: 100nF; Link: https://www.lcsc.com/product-detail/C14663.html; Tolerance: ±10%; Voltage Rating: 50V
C24 = C0603_MLCC_1uF_X7R_50V: 50V 1uF X7R ±10% 0603 Multilayer Ceramic Capacitors MLCC - SMD/SMT ROHS; Manufacturer: YAGEO; Mfr. Part: CC0603KRX7R9BB105; LCSC Part: C559769; Capacitance: 1uF; Link: https://www.lcsc.com/product-detail/C559769.html; Tolerance: ±10%; Voltage Rating: 50V
C25 C26 = C0603_MLCC_33pF_NP0_50V: 50V 33pF NP0 ±5% 0603 Multilayer Ceramic Capacitors MLCC - SMD/SMT ROHS; Manufacturer: YAGEO; Mfr. Part: CC0603JRNPO9BN330; LCSC Part: C107047; Capacitance: 33pF; Link: https://www.lcsc.com/product-detail/C107047.html; Tolerance: ±5%; Voltage Rating: 50V
C27 = C0603_MLCC_10uF_X5R_25V: as C10 on sheet VOLTAGE SOURCE; LCSC Part: C596327; Capacitance: 10uF; Link: https://www.lcsc.com/product-detail/C596327.html; Tolerance: ±20%; Voltage Rating: 25V
C28 = C0603_MLCC_10nF_X7R_50V: 50V 10nF X7R ±10% 0603 Multilayer Ceramic Capacitors MLCC - SMD/SMT ROHS; Manufacturer: YAGEO; Mfr. Part: CC0603KRX7R9BB103; LCSC Part: C100042; Capacitance: 10nF; Link: https://www.lcsc.com/product-detail/C100042.html; Tolerance: ±10%; Voltage Rating: 50V
C30 = C0603_MLCC_10pF_NP0_50V: 50V 10pF NP0 ±5% 0603 Multilayer Ceramic Capacitors MLCC - SMD/SMT ROHS; Manufacturer: YAGEO; Mfr. Part: CC0603JRNPO9BN100; LCSC Part: C106245; Capacitance: 10pF; Link: https://www.lcsc.com/product-detail/C106245.html; Tolerance: ±5%; Voltage Rating: 50V
IC5 = CP2102: 12Mbps Transceiver WQFN-28-EP(5x5) USB Converters ROHS; Manufacturer: SILICON LABS; Mfr. Part: CP2102-GMR; Key Attributes: Single-Chip USB to UART Bridge; Voltage - Supply: 3V~3.6V; Link: https://www.lcsc.com/product-detail/C6568.html?s_z=n_CP2102-GMR; Data Rate: 12Mbps; Applications Function: Transceiver; LCSC Part: C6568; Package: WQFN-28-EP(5x5)
LED2 = LED0603_Blue: 2mA 24mcd Water Clear -40℃~+85℃ 470nm Blue 130° 120mW 2.65V 0603 LED Indication - Discrete ROHS; Manufacturer: Kingbright; Mfr. Part: APT1608LVBC/D; Key Attributes: 1.6 x 0.8 mm SMD Chip LED Lamp; LCSC Part: C5200747; Illumination Color: Blue; Power(Watts): 120mW; Voltage - Forward(Vf): 2.65V; Forward Current: 2mA; Operating Temperature: -40℃~+85℃; Link: https://www.lcsc.com/product-detail/C5200747.html
R10-R13 R15 = R0603_10kΩ_±1%: as R3 on sheet VOLTAGE SOURCE; LCSC Part: C98220; Resistance: 10kΩ; Operating Temperature: -55℃~+155℃; Link: https://www.lcsc.com/product-detail/C98220.html
R14 = R0603_1kΩ_±1%: as R7 on sheet VOLTAGE SOURCE; LCSC Part: C22548; Resistance: 1kΩ; Operating Temperature: -55℃~+155℃; Link: https://www.lcsc.com/product-detail/C22548.html
R16 = R0603_330Ω_±1%: 100mW Thick Film Resistor 75V ±100ppm/℃ ±1% 330Ω 0603 Chip Resistor - Surface Mount ROHS; Manufacturer: YAGEO; Mfr. Part: RC0603FR-07330RL; LCSC Part: C105881; Resistance: 330Ω; Operating Temperature: -55℃~+155℃; Link: https://www.lcsc.com/product-detail/C105881.html
RESET = SW_BUTTON_SMD_3mm×4mm: Without Bracket 50mA 4mm 100,000 Cycles 12V 1.6N 3mm 2mm Round Button Surface Mount,Vertical SPST SMD Tactile Switches ROHS; Manufacturer: XUNPU; LCSC Part: C720477; Package: SMD; Length: 4mm; Width: 3mm; Voltage Rating: 12V; Operating Temperature: -30℃~+80℃; Link: https://www.lcsc.com/product-detail/C720477.html?s_z=n_Button
T1 T2 = BS170F: 90V 150uA 5Ω@10V 330mW 3V@1mA 1 N-Channel SOT-23 MOSFETs ROHS; Manufacturer: DIODES; Package: SOT-23; LCSC Part: C151050; Category: Transistors/Thyristors/MOSFETs; Number: BS170F; Gate Threshold Voltage (Vgs(th)): 3V@1mA; Link: https://www.lcsc.com/product-detail/C151050.html?s_z=n_BS170
TP7 TP8 = TEST_POINT
U3 = ATMEGA328P-AU: AVR 20MHz TQFP-32(7x7) Microcontrollers (MCU/MPU/SOC) ROHS; Manufacturer: MICROCHIP; Key Attributes: 8-bit Microcontroller with In-System Programmable Flash; ADC (Bit): 10bit; Number of I/O: 23; Program Memory Type: FLASH; EEPROM: 1KB; Program Storage Size: 32KB; Voltage - Supply: 1.8V~5.5V; Mfr. Part: ATMEGA328P-AU; LCSC Part: C14877; CPU Core: AVR; CPU Maximum Speed: 20MHz; Link: https://www.lcsc.com/product-detail/C14877.html
X1 = Crystal_16Mhz_HC49S: 16MHz Through Hole Crystal Oscillator 20pF ±20ppm ±30ppm HC-49S Crystals ROHS; Manufacturer: YXC Crystal Oscillators; Mfr. Part: X49SD16MSD2SC; LCSC Part: C16212; Frequency: 16MHz; Type: Through Hole Crystal Oscillator; Load Capacitance: 20pF; Frequency Stability: ±30ppm; Operating Temperature: -20℃~+70℃; Link: https://www.lcsc.com/product-detail/C16212.html; Package: HC-49S

## Sheet PERIPHERALS.SchDoc: PERIPHERALS
size A3; Author: NGUYEN QUANG MINH; SheetNumber: 5; SheetTotal: 5; ProjectTitle: Arduino_DIY_V1.0
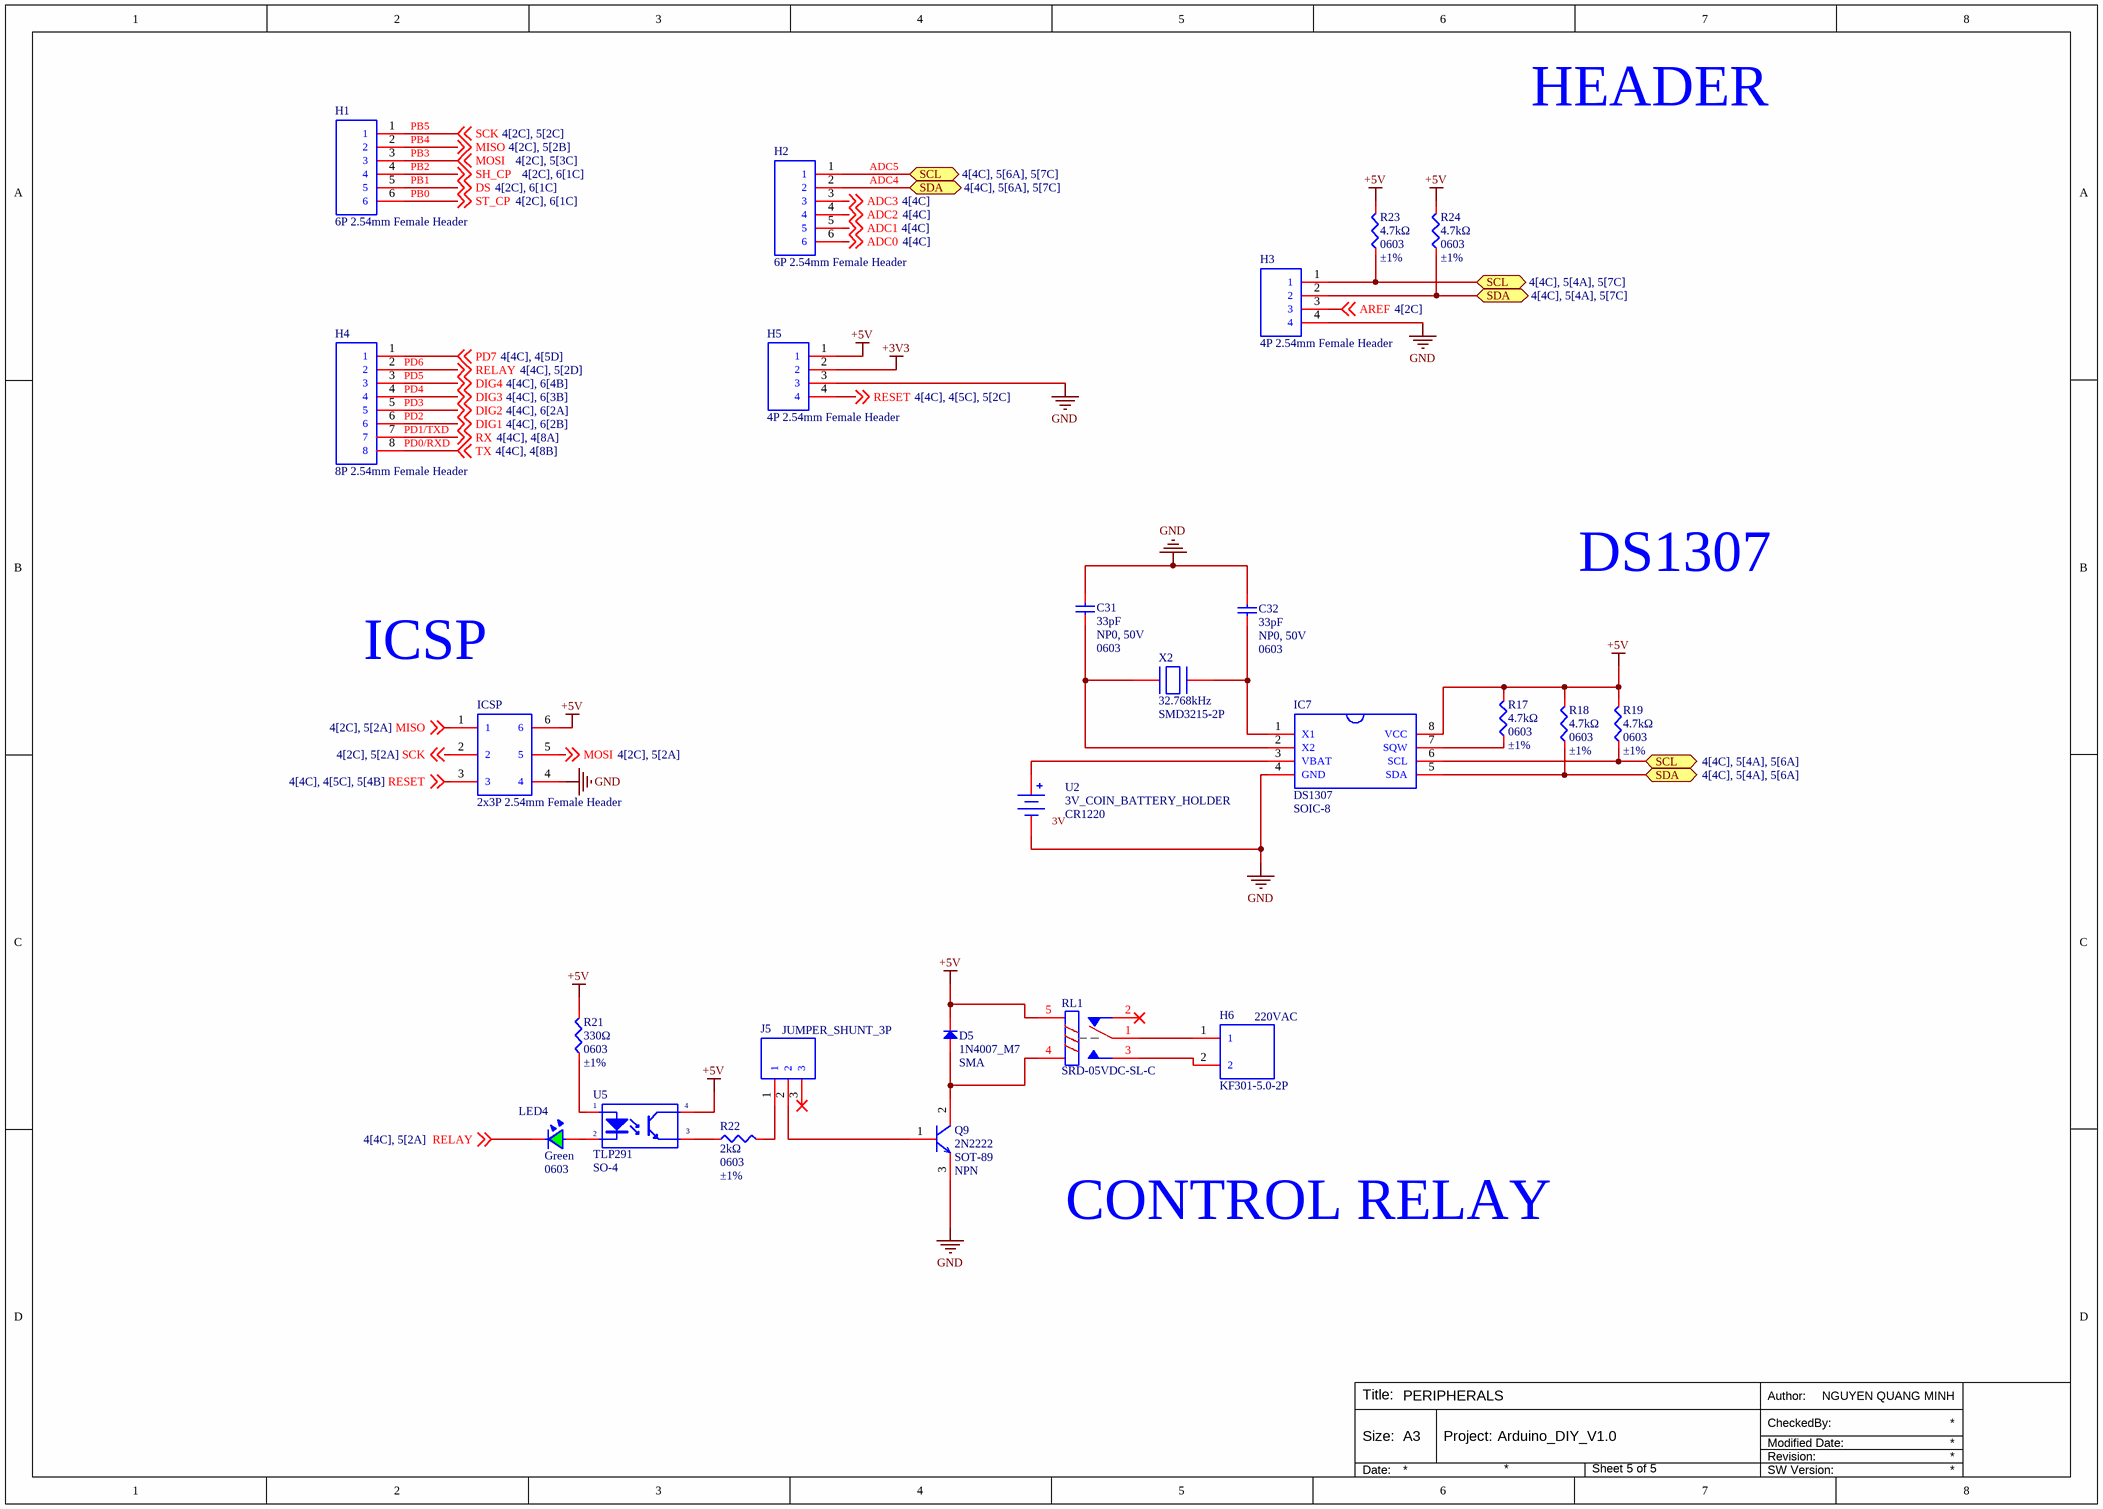
[diagram p4: PERIPHERALS.SchDoc]

### Parts
C31  33pF  Temperature Coefficient: NP0, 50V  Package: 0603  [C0603]
C32  33pF  Temperature Coefficient: NP0, 50V  Package: 0603  [C0603]
D5  1N4007_M7  Package: SMA  [SMA(DO-214AC)]
H1  6P 2.54mm Female Header  [6P, 2,54mm, FEMALE HEADER]
H2  6P 2.54mm Female Header  [6P, 2,54mm, FEMALE HEADER]
H3  4P 2.54mm Female Header  [4P, 2,54mm, FEMALE HEADER]
H4  8P 2.54mm Female Header  [8P, 2,54mm, FEMALE HEADER]
H5  4P 2.54mm Female Header  [4P, 2,54mm, FEMALE HEADER]
H6  KF301-5.0-2P  CONFIGURE: 220VAC  [CONN-TH_P5.00_KF301-5.0-2P]
IC7  DS1307  [SOIC-8]
ICSP  2x3P 2.54mm Female Header  [2x3P, 2.54mm, Female Header]
J5  JUMPER_SHUNT_3P  [JUMPER_SHUNT_3P]
LED4  Green  Package: 0603  [LED0603_GREEN]
Q9  2N2222  Package: SOT-89  Type: NPN  [SOT-89-3L]
R17  4.7kΩ  Package: 0603  Tolerance: ±1%  [R0603]
R18  4.7kΩ  Package: 0603  Tolerance: ±1%  [R0603]
R19  4.7kΩ  Package: 0603  Tolerance: ±1%  [R0603]
R21  330Ω  Package: 0603  Tolerance: ±1%  [R0603]
R22  2kΩ  Package: 0603  Tolerance: ±1%  [R0603]
R23  4.7kΩ  Package: 0603  Tolerance: ±1%  [R0603]
R24  4.7kΩ  Package: 0603  Tolerance: ±1%  [R0603]
RL1  SRD-05VDC-SL-C  [Through Hole,15.6x19.2mm]
U2  3V_COIN_BATTERY_HOLDER  Battery Type: CR1220  [3V_COIN_BATERRY_HOLDER_CR1220]
U5  TLP291  [SO-4]
X2  32.768kHz  [SMD3215-2P]

### Ports
SCL (bidir, see 4[4C], 5[4A], 5[6A]), SCL (bidir, see 4[4C], 5[4A], 5[7C]), SCL (bidir, see 4[4C], 5[6A], 5[7C]), SDA (bidir, see 4[4C], 5[4A], 5[6A]), SDA (bidir, see 4[4C], 5[4A], 5[7C]), SDA (bidir, see 4[4C], 5[6A], 5[7C])

### Nets
+3V3: H5.2
+5V: D5.1 H5.1 IC7.8(VCC) ICSP.6 R17.2 R18.2 R19.2 R21.2 R23.2 R24.2 RL1.5 U5.4(C)
GND: C31.2 C32.2 H3.4 H5.3 IC7.4(GND) ICSP.4 Q9.3(E) U2.2
ADC0: H2.6 ; off-sheet ADC0
ADC1: H2.5 ; off-sheet ADC1
ADC2: H2.4 ; off-sheet ADC2
ADC3: H2.3 ; off-sheet ADC3
AREF: H3.3 ; off-sheet AREF
DIG1: H4.6 ; off-sheet DIG1
DIG2: H4.5 ; off-sheet DIG2
DIG3: H4.4 ; off-sheet DIG3
DIG4: H4.3 ; off-sheet DIG4
DS: H1.5 ; off-sheet DS
MISO: H1.2 ICSP.1 ; off-sheet MISO
MOSI: H1.3 ICSP.5 ; off-sheet MOSI
PD7: H4.1 ; off-sheet PD7
RELAY: H4.2 LED4.2 ; off-sheet RELAY
RESET: H5.4 ICSP.3 ; off-sheet RESET
RX: H4.7 ; off-sheet RX
SCK: H1.1 ICSP.2 ; off-sheet SCK
SH_CP: H1.4 ; off-sheet SH_CP
ST_CP: H1.6 ; off-sheet ST_CP
TX: H4.8 ; off-sheet TX
NetC31_1: C31.1 IC7.2(X2) X2.2
NetC32_1: C32.1 IC7.1(X1) X2.1
NetD5_2: D5.2 Q9.2(C) RL1.4
NetH2_1: H2.1 H3.1 IC7.6(SCL) R19.1 R23.1 ; port SCL
NetH2_2: H2.2 H3.2 IC7.5(SDA) R18.1 R24.1 ; port SDA
NetH6_1: H6.1 RL1.1
NetH6_2: H6.2 RL1.3
NetIC7_3: IC7.3(VBAT) U2.1
NetIC7_7: IC7.7(SQW) R17.1
NetJ5_1: J5.1 R22.2
NetJ5_2: J5.2 Q9.1(B)
NetLED4_1: LED4.1 U5.2(K)
NetR21_1: R21.1 U5.1(A)
NetR22_1: R22.1 U5.3(E)

Not connected (* = marked no-connect by the designer): J5 3*; RL1 2*

### Notes on the sheet
- (near H1) PB1
- (near H1) PB2
- (near H1) PB3
- (near H1) PB4
- (near H1) PB5
- ADC4
- ADC5
- HEADER
- (near H1) PB0
- (near H4) PD5
- (near H4) PD6
- (near H4) PD0/RXD
- (near H4) PD1/TXD
- (near H4) PD2
- (near H4) PD3
- (near H4) PD4
- DS1307
- ICSP
- CONTROL RELAY
- Author:
- Title:
- Size:
- A3
- Project:
- Revision:
- Modified Date:
- CheckedBy:
- Date:
- SW Version:
- (in symbol 3V_COIN_BATTERY_HOLDER) 3V

### Library data of the parts
C31 C32 = C0603_MLCC_33pF_NP0_50V: as C25 on sheet MCU; LCSC Part: C107047; Capacitance: 33pF; Link: https://www.lcsc.com/product-detail/C107047.html; Tolerance: ±5%; Voltage Rating: 50V
D5 = 1N4007_M7: 1A 1V@1A 1kV SMA Diodes - General Purpose ROHS; Manufacturer: JSMSEMI; Mfr. Part: 1N4007 M7; LCSC Part: C20754788; Link: https://www.lcsc.com/product-detail/C20754788.html?s_z=n_1N4007
H1 H2 = 6P 2.54mm Female Header: 2.54mm 1 6P Through Hole 1x6P Through Hole,P=2.54mm Female Headers ROHS; Manufacturer: BOOMELE(Boom Precision Elec); Mfr. Part: 2.54-1*6P; LCSC Part: C40877; Package: Through Hole,P=2.54mm; Holes Structure: 1x6P; Link: https://www.lcsc.com/product-detail/C40877.html; Pitch: 2.54mm
H3 H5 = 4P 2.54mm Female Header: 2.54mm 1 3A 4P Bronze -40℃~+105℃ Through Hole 1x4P Top Square Hole Through Hole,P=2.54mm Female Headers ROHS; Manufacturer: BOOMELE(Boom Precision Elec); Mfr. Part: 2.54-1*4P; LCSC Part: C2718488; Package: Through Hole,P=2.54mm; Holes Structure: 1x4P; Link: https://www.lcsc.com/product-detail/C2718488.html; Pitch: 2.54mm
H4 = 8P 2.54mm Female Header: 2.54mm 1 8P Through Hole 1x8P Through Hole,P=2.54mm Female Headers ROHS; Manufacturer: BOOMELE(Boom Precision Elec); Mfr. Part: 2.54-1*8P; LCSC Part: C27438; Package: Through Hole,P=2.54mm; Holes Structure: 1x8P; Link: https://www.lcsc.com/product-detail/C27438.html; Pitch: 2.54mm
H6 = KF301-5.0-2P: 1x2P -30℃~+120℃ 17A 250V Blue 14~22 Through Hole 5mm 1.5 1 2 Through Hole,P=5mm Screw Terminal Blocks ROHS; Manufacturer: Cixi Kefa Elec; Mfr. Part: KF301-5.0-2P; LCSC Part: C474881; Package: Through Hole,P=5mm; Category: Connectors/Screw Terminal Blocks; Color: Blue; Link: https://www.lcsc.com/product-detail/C474881.html
IC7 = DS1307-SOIC8: I2C SOIC-8 Real Time Clocks ROHS; Manufacturer: MAXIM; Mfr. Part: DS1307Z+T&R; Key Attributes: 64 x 8, Serial, I²C Real-Time Clock; LCSC Part: C9868; Link: https://www.lcsc.com/product-detail/C9868.html?s_z=n_DS1307; Interface: I2C; Package: SOIC-8
ICSP = 2x3P 2.54mm Female Header: 2.54mm 2.54mm 3A 2 6P -40℃~+105℃ Through Hole 2x3P Top Square Hole Through Hole,P=2.54mm Female Headers ROHS; Manufacturer: HanElectricity; Mfr. Part: 2541FV-2x3P; LCSC Part: C18723054; Package: Through Hole,P=2.54mm; Holes Structure: 2x3P; Link: https://www.lcsc.com/product-detail/C18723054.html?s_z=n_HanElectricity%25202541FV-2x3P
J5 = JUMPER_SHUNT_3P: 250V 3A Through Hole Pin Header 2.5mm 3P 6mm -40℃~+105℃ 3mm 2.54mm 1 Black 1x3P Through Hole,P=2.54mm Pin Headers ROHS; Manufacturer: XFCN; Mfr. Part: PZ254V-11-03P; LCSC Part: C2937625; Package: Through Hole,P=2.54mm; Insulation Height: Insulation Height; Number of Rows: 1; Link: https://www.lcsc.com/product-detail/C2937625.html; Pin Structure: 1x3P
LED4 = LED0603_Green: 2mA 20mcd~50mcd Water Clear 525nm -40℃~+85℃ Green 130° 75mW 2.65V 0603 LED Indication - Discrete ROHS; Manufacturer: Kingbright; Mfr. Part: KPT-1608LVZGCK; Key Attributes: 1.6X0.8mm SMD CHIP LED LAMP; LCSC Part: C598356; Illumination Color: Green; Power(Watts): 75mW; Voltage - Forward(Vf): 2.65V; Forward Current: 2mA; Operating Temperature: -40℃~+85℃; Link: https://www.lcsc.com/product-detail/C598356.html
Q9 = 2N2222_SOT-89: 40V 500mW 600mA NPN SOT-89 Bipolar (BJT) ROHS; Manufacturer: CBI; Mfr. Part: 2N2222AU; Transition frequency(fT): 300MHz; Vce Saturation(VCE(sat)): 1V@500mA.50mA; LCSC Part: C21714170; Pd - Power Dissipation: 500mW; Current - Collector(Ic): 600mA; Link: https://www.lcsc.com/product-detail/C21714170.html?s_z=n_2N2222; Category: BJT
R17-R19 R23 R24 = R0603_4.7kΩ_±1%: 100mW Thick Film Resistor 75V ±100ppm/℃ ±1% 4.7kΩ 0603 Chip Resistor - Surface Mount ROHS; Manufacturer: YAGEO; Mfr. Part: RC0603FR-074K7L; LCSC Part: C99782; Resistance: 4.7kΩ; Operating Temperature: -55℃~+155℃; Link: https://www.lcsc.com/product-detail/C99782.html
R21 = R0603_330Ω_±1%: as R16 on sheet MCU; LCSC Part: C105881; Resistance: 330Ω; Operating Temperature: -55℃~+155℃; Link: https://www.lcsc.com/product-detail/C105881.html
R22 = R0603_2kΩ_±1%: as R6 on sheet VOLTAGE SOURCE; LCSC Part: C105576; Resistance: 2kΩ; Operating Temperature: -55℃~+155℃; Link: https://www.lcsc.com/product-detail/C105576.html
RL1 = SRD-05VDC-SL-C: 250V@AC 5V 15A 1 Form C: 1C (SPDT-CO) Through Hole,15.6x19.2mm Power Relays ROHS; Manufacturer: Songle Relay; Mfr. Part: SRD-05VDC-SL-C; LCSC Part: C35449; Package: Through Hole,15.6x19.2mm; Switching Voltage(Max): 250V@AC; Coil Voltage: 5V; Switching Current(Max): 15A; Number of Pins: 5; Link: https://www.lcsc.com/product-detail/C35449.html?s_z=n_relay
U2 = 3V_COIN_BATTERY_HOLDER: Battery Holder -25℃~+85℃ Phosphor Bronze CR1220 SMD Button And Strip Battery Connector ROHS; Manufacturer: MYOUNG; Mfr. Part: BS-12-B3AA003; LCSC Part: C964723; Package: SMD; Link: https://www.lcsc.com/product-detail/C964723.html
U5 = TLP291: SO-4 Transistor, Photovoltaic Output Optoisolators ROHS; Manufacturer: TOSHIBA; Mfr. Part: TLP291(GB-TP,SE(T; LCSC Part: C5255297; Package: SO-4
X2 = Crystal_32.768Khz: 32.768kHz 12.5pF ±20ppm SMD3215-2P Crystals ROHS; Manufacturer: NDK; Mfr. Part: NX3215SA-32.768K-STD-MUA-8; LCSC Part: C156245; Frequency: 32.768kHz; Type: -; Load Capacitance: 12.5pF; Frequency Stability: -; Operating Temperature: -40℃~+85℃; Link: https://www.lcsc.com/product-detail/C156245.html?s_z=n_Crystal%252032%252C768kHz; Package: SMD3215-2P

## Sheet 4 DIGIT 7 SEGMENT.SchDoc: 4 DIGIT 7 SEGMENT
size A4; Author: NGUYEN QUANG MINH; SheetNumber: 6; SheetTotal: 6
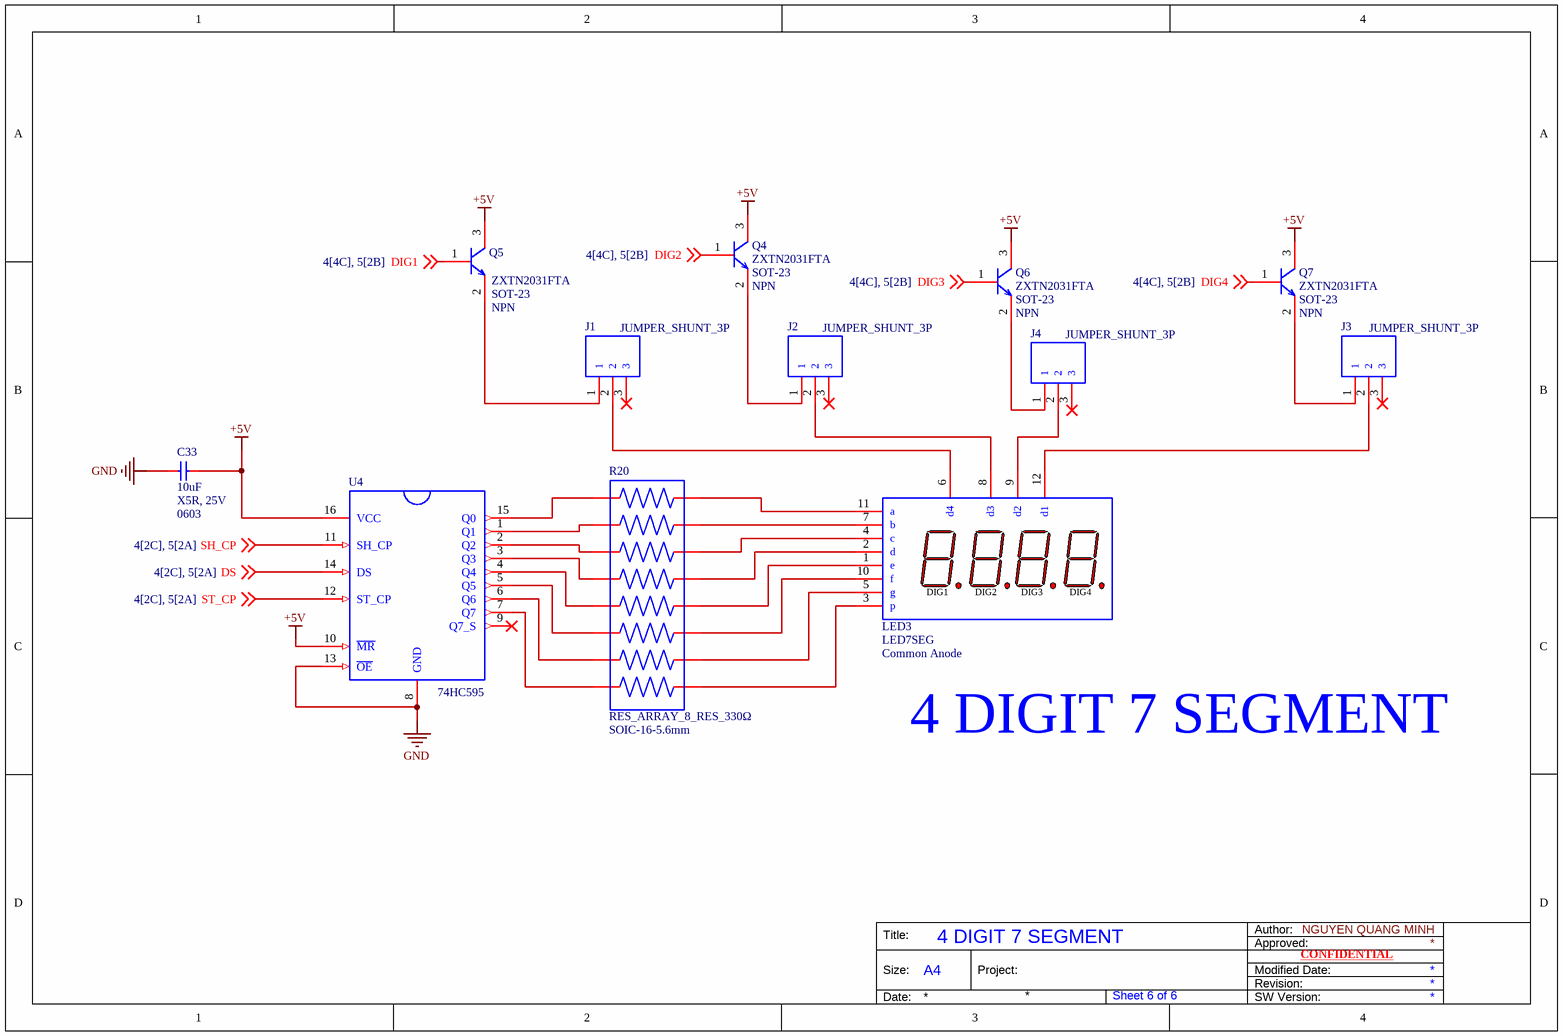
[diagram p5: 4 DIGIT 7 SEGMENT.SchDoc]

### Parts
C33  10uF  Temperature Coefficient: X5R, 25V  Package: 0603  [C0603]
J1  JUMPER_SHUNT_3P  [JUMPER_SHUNT_3P]
J2  JUMPER_SHUNT_3P  [JUMPER_SHUNT_3P]
J3  JUMPER_SHUNT_3P  [JUMPER_SHUNT_3P]
J4  JUMPER_SHUNT_3P  [JUMPER_SHUNT_3P]
LED3  LED7SEG  LED Polarity: Common Anode  [LED7SEG_4]
Q4  ZXTN2031FTA  Type: NPN  [SOT-23]
Q5  ZXTN2031FTA  Type: NPN  [SOT-23]
Q6  ZXTN2031FTA  Type: NPN  [SOT-23]
Q7  ZXTN2031FTA  Type: NPN  [SOT-23]
R20  RES_ARRAY_8_RES_330Ω  [SOIC-16-5.6mm]
U4  74HC595  [TSSOP16]

### Nets
+5V: C33.1 Q4.3(C) Q5.3(C) Q6.3(C) Q7.3(C) U4.10(~{MR}) U4.16(VCC)
GND: C33.2 U4.8(GND) U4.13(~{OE})
DIG1: Q5.1(B) ; off-sheet DIG1
DIG2: Q4.1(B) ; off-sheet DIG2
DIG3: Q6.1(B) ; off-sheet DIG3
DIG4: Q7.1(B) ; off-sheet DIG4
DS: U4.14(DS) ; off-sheet DS
SH_CP: U4.11(SH_CP) ; off-sheet SH_CP
ST_CP: U4.12(ST_CP) ; off-sheet ST_CP
NetJ1_1: J1.1 Q5.2(E)
NetJ1_2: J1.2 LED3.6(d4)
NetJ2_1: J2.1 Q4.2(E)
NetJ2_2: J2.2 LED3.8(d3)
NetJ3_1: J3.1 Q7.2(E)
NetJ3_2: J3.2 LED3.12(d1)
NetJ4_1: J4.1 Q6.2(E)
NetJ4_2: J4.2 LED3.9(d2)
NetLED3_1: LED3.1(e) R20.12
NetLED3_2: LED3.2(d) R20.13
NetLED3_3: LED3.3(p) R20.9
NetLED3_4: LED3.4(c) R20.14
NetLED3_5: LED3.5(g) R20.10
NetLED3_7: LED3.7(b) R20.15
NetLED3_10: LED3.10(f) R20.11
NetLED3_11: LED3.11(a) R20.16
NetR20_1: R20.1 U4.15(Q0)
NetR20_2: R20.2 U4.1(Q1)
NetR20_3: R20.3 U4.2(Q2)
NetR20_4: R20.4 U4.3(Q3)
NetR20_5: R20.5 U4.4(Q4)
NetR20_6: R20.6 U4.5(Q5)
NetR20_7: R20.7 U4.6(Q6)
NetR20_8: R20.8 U4.7(Q7)

Not connected (* = marked no-connect by the designer): J1 3*; J2 3*; J3 3*; J4 3*; U4 9(Q7_S)*

### Notes on the sheet
- 4 DIGIT 7 SEGMENT
- Author:
- Title:
- Size:
- A4
- Project:
- Approved:
- Revision:
- Modified Date:
- CONFIDENTIAL
- Date:
- SW Version:
- (in symbol LED7SEG_Common_Anode) DIG1; DIG2; DIG3; DIG4

### Library data of the parts
C33 = C0603_MLCC_10uF_X5R_25V: as C10 on sheet VOLTAGE SOURCE; LCSC Part: C596327; Capacitance: 10uF; Link: https://www.lcsc.com/product-detail/C596327.html; Tolerance: ±20%; Voltage Rating: 25V
J1-J4 = JUMPER_SHUNT_3P: as J5 on sheet PERIPHERALS; LCSC Part: C2937625; Package: Through Hole,P=2.54mm; Insulation Height: Insulation Height; Number of Rows: 1; Link: https://www.lcsc.com/product-detail/C2937625.html; Pin Structure: 1x3P
LED3 = LED7SEG_Common_Anode: Red 4 Common Anode 0.56 Through Hole LED Segment Displays ROHS; Manufacturer: ZHIHAO; Mfr. Part: FJ5461BH; LCSC Part: C10713; Package: Through Hole; Link: https://www.lcsc.com/product-detail/C10713.html; Illumination Color: Red
Q4-Q7 = ZXTN2031FTA: 50V 200@2A,2V 1.2W 5A NPN SOT-23 Bipolar (BJT) ROHS; Manufacturer: DIODES; Transition frequency(fT): 125MHz; Mfr. Part: ZXTN2031FTA; LCSC Part: C92166; Pd - Power Dissipation: 1.2W; Operating Temperature: -55℃~+150℃; Current - Collector(Ic): 5A; Vce Saturation(VCE(sat)): Vce Saturation(VCE(sat)); Link: https://www.lcsc.com/product-detail/C92166.html; Category: BJT; Package: SOT-23
R20 = RES_ARRAY_8_RES_330Ω: 8 ±2% 330Ω 160mW ±100ppm/℃ SOIC-16-5.6mm Resistor Networks, Arrays ROHS; Manufacturer: BOURNS; Number of Resistors: 8; Number of Pins: 16; Tolerance: ±2%; Resistance: 330Ω; Link: https://www.lcsc.com/product-detail/C1731150.html; Package: SOIC-16-5.6mm
U4 = 74HC595: 8 2V~6V 1 Serial-to-Serial or Parallel TSSOP-16 Shift Registers ROHS; Manufacturer: Nexperia; Mfr. Part: 74HC595PW,118; Package: TSSOP16-16 Nexperia USA Inc.; LCSC Part: C5948; Voltage - Supply: 2V~6V; Link: https://www.lcsc.com/product-detail/C5948.html?s_z=n_74hc595

## Nets that join several sheets
+3V3: VOLTAGE SOURCE (C18.2 C19.2 IC4.2 TP5.1), MCU (8 pins), PERIPHERALS (H5.2)
+5V: VOLTAGE SOURCE (7 pins), MCU (14 pins), PERIPHERALS (12 pins), 4 DIGIT 7 SEGMENT (7 pins)
GND: VOLTAGE SOURCE (52 pins), MCU (14 pins), PERIPHERALS (8 pins), 4 DIGIT 7 SEGMENT (C33.2 U4.8 U4.13)
ADC0: MCU (U3.23), PERIPHERALS (H2.6)
ADC1: MCU (U3.24), PERIPHERALS (H2.5)
ADC2: MCU (U3.25), PERIPHERALS (H2.4)
ADC3: MCU (U3.26), PERIPHERALS (H2.3)
AREF: MCU (C29.2 U3.20), PERIPHERALS (H3.3)
DATA+: VOLTAGE SOURCE (JP1.A6 JP1.B6), MCU (IC5.4)
DATA-: VOLTAGE SOURCE (JP1.A7 JP1.B7), MCU (IC5.5)
DIG1: MCU (U3.32), PERIPHERALS (H4.6), 4 DIGIT 7 SEGMENT (Q5.1)
DIG2: MCU (U3.1), PERIPHERALS (H4.5), 4 DIGIT 7 SEGMENT (Q4.1)
DIG3: MCU (U3.2), PERIPHERALS (H4.4), 4 DIGIT 7 SEGMENT (Q6.1)
DIG4: MCU (U3.9), PERIPHERALS (H4.3), 4 DIGIT 7 SEGMENT (Q7.1)
DS: MCU (U3.13), PERIPHERALS (H1.5), 4 DIGIT 7 SEGMENT (U4.14)
MISO: MCU (U3.16), PERIPHERALS (H1.2 ICSP.1)
MOSI: MCU (U3.15), PERIPHERALS (H1.3 ICSP.5)
NetH2_1: MCU (U3.28), PERIPHERALS (5 pins)
NetH2_2: MCU (U3.27), PERIPHERALS (5 pins)
PD7: MCU (R16.1 U3.11), PERIPHERALS (H4.1)
RELAY: MCU (U3.10), PERIPHERALS (H4.2 LED4.2)
RESET: MCU (C30.1 R15.1 RESET.1 U3.29), PERIPHERALS (H5.4 ICSP.3)
RX: MCU (R11.1 T1.3 U3.31), PERIPHERALS (H4.7)
SCK: MCU (U3.17), PERIPHERALS (H1.1 ICSP.2)
SH_CP: MCU (U3.14), PERIPHERALS (H1.4), 4 DIGIT 7 SEGMENT (U4.11)
ST_CP: MCU (U3.12), PERIPHERALS (H1.6), 4 DIGIT 7 SEGMENT (U4.12)
TX: MCU (R12.1 T2.3 U3.30), PERIPHERALS (H4.8)